# Altium project Top_floor.PrjPcb
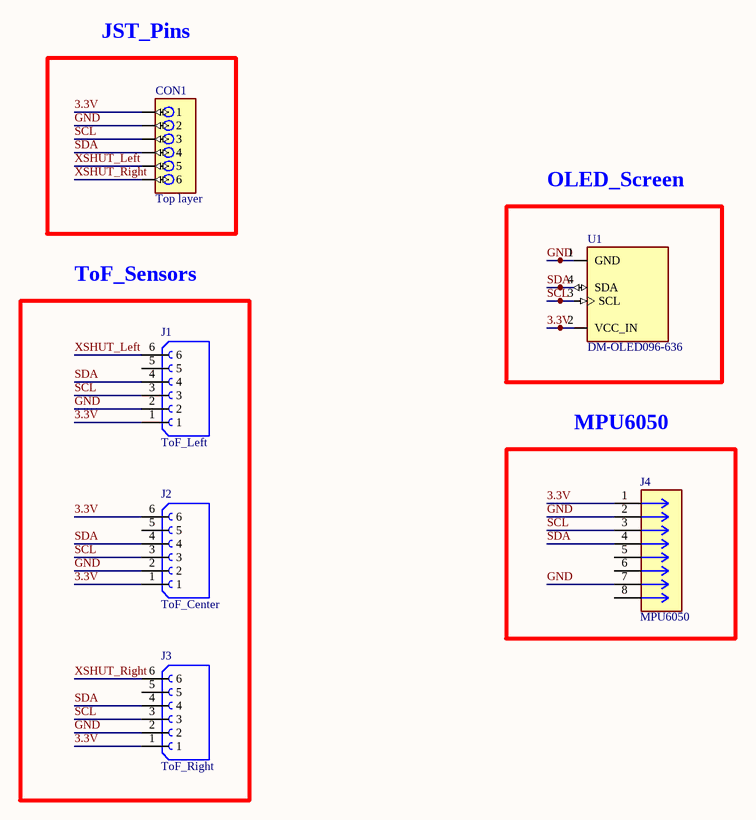
[diagram p0: Sheet1.SchDoc]
1 sheet, 6 parts. Net scope: global (net labels, ports and power ports of the same name join across sheets).
Board file: PCB1.PcbDoc

## Sheet Sheet1.SchDoc
size A; SheetNumber: 1; SheetTotal: 1

### Parts
CON1  Top layer  [6 pin JST]
J1  ToF_Left  [6 pin female header]
J2  ToF_Center  [6 pin female header]
J3  ToF_Right  [6 pin female header]
J4  MPU6050  [8 Pin Female Headers]
U1  DM-OLED096-636  [MODULE_DM-OLED096-636]

### Blocks framed on the sheet
JST_Pins: CON1
OLED_Screen: U1
ToF_Sensors: J1-J3
MPU6050: J4

### Nets
3.3V: CON1.1 J1.1 J2.1 J2.6 J3.1 J4.1 U1.2(VCC_IN)
GND: CON1.2 J1.2 J2.2 J3.2 J4.2 J4.7 U1.1(GND)
SCL: CON1.3 J1.3 J2.3 J3.3 J4.3 U1.3(SCL)
SDA: CON1.4 J1.4 J2.4 J3.4 J4.4 U1.4(SDA)
XSHUT_Left: CON1.5 J1.6
XSHUT_Right: CON1.6 J3.6

Not connected (* = marked no-connect by the designer): J1 5; J2 5; J3 5; J4 5 6 8

### Library data of the parts
CON1 = 6 pin JST: Connector Header Surface Mount 6 position 0.059 (1.50mm); MF: JST; MP: B6B-ZR; SnapEDA_Link: https://www.snapeda.com/parts/B6B-ZR/JST/view-part/?ref=snap; Package: None; Value: *; Check_prices: https://www.snapeda.com/parts/B6B-ZR/JST/view-part/?ref=eda
J1-J3 = 6 pin female header: MF: Sullins Connector Solutions; MP: PPTC061LFBNRC; SnapEDA_Link: https://www.snapeda.com/parts/PPTC061LFBNRC/Sullins/view-part/?ref=snap; Package: None; Value: *; Check_prices: https://www.snapeda.com/parts/PPTC061LFBNRC/Sullins/view-part/?ref=eda
J4 = 8 pin Female Headers: MP: 395011008; Package: None; Price: None; Value: *; Availability: Unavailable
U1 = DM-OLED096-636: 0.96â€ 128 X 64 MONOCHROME GRAPHIC OLED DISPLAY MODULE - I2C; SnapEDA_Link: https://www.snapeda.com/parts/DM-OLED096-636/Display+Module/view-part/?ref=snap; Package: Package; Value: *; MF: Display Module; MP: DM-OLED096-636; Check_prices: https://www.snapeda.com/parts/DM-OLED096-636/Display+Module/view-part/?ref=eda